# EAGLE design extruder4 (EAGLE 4.16)
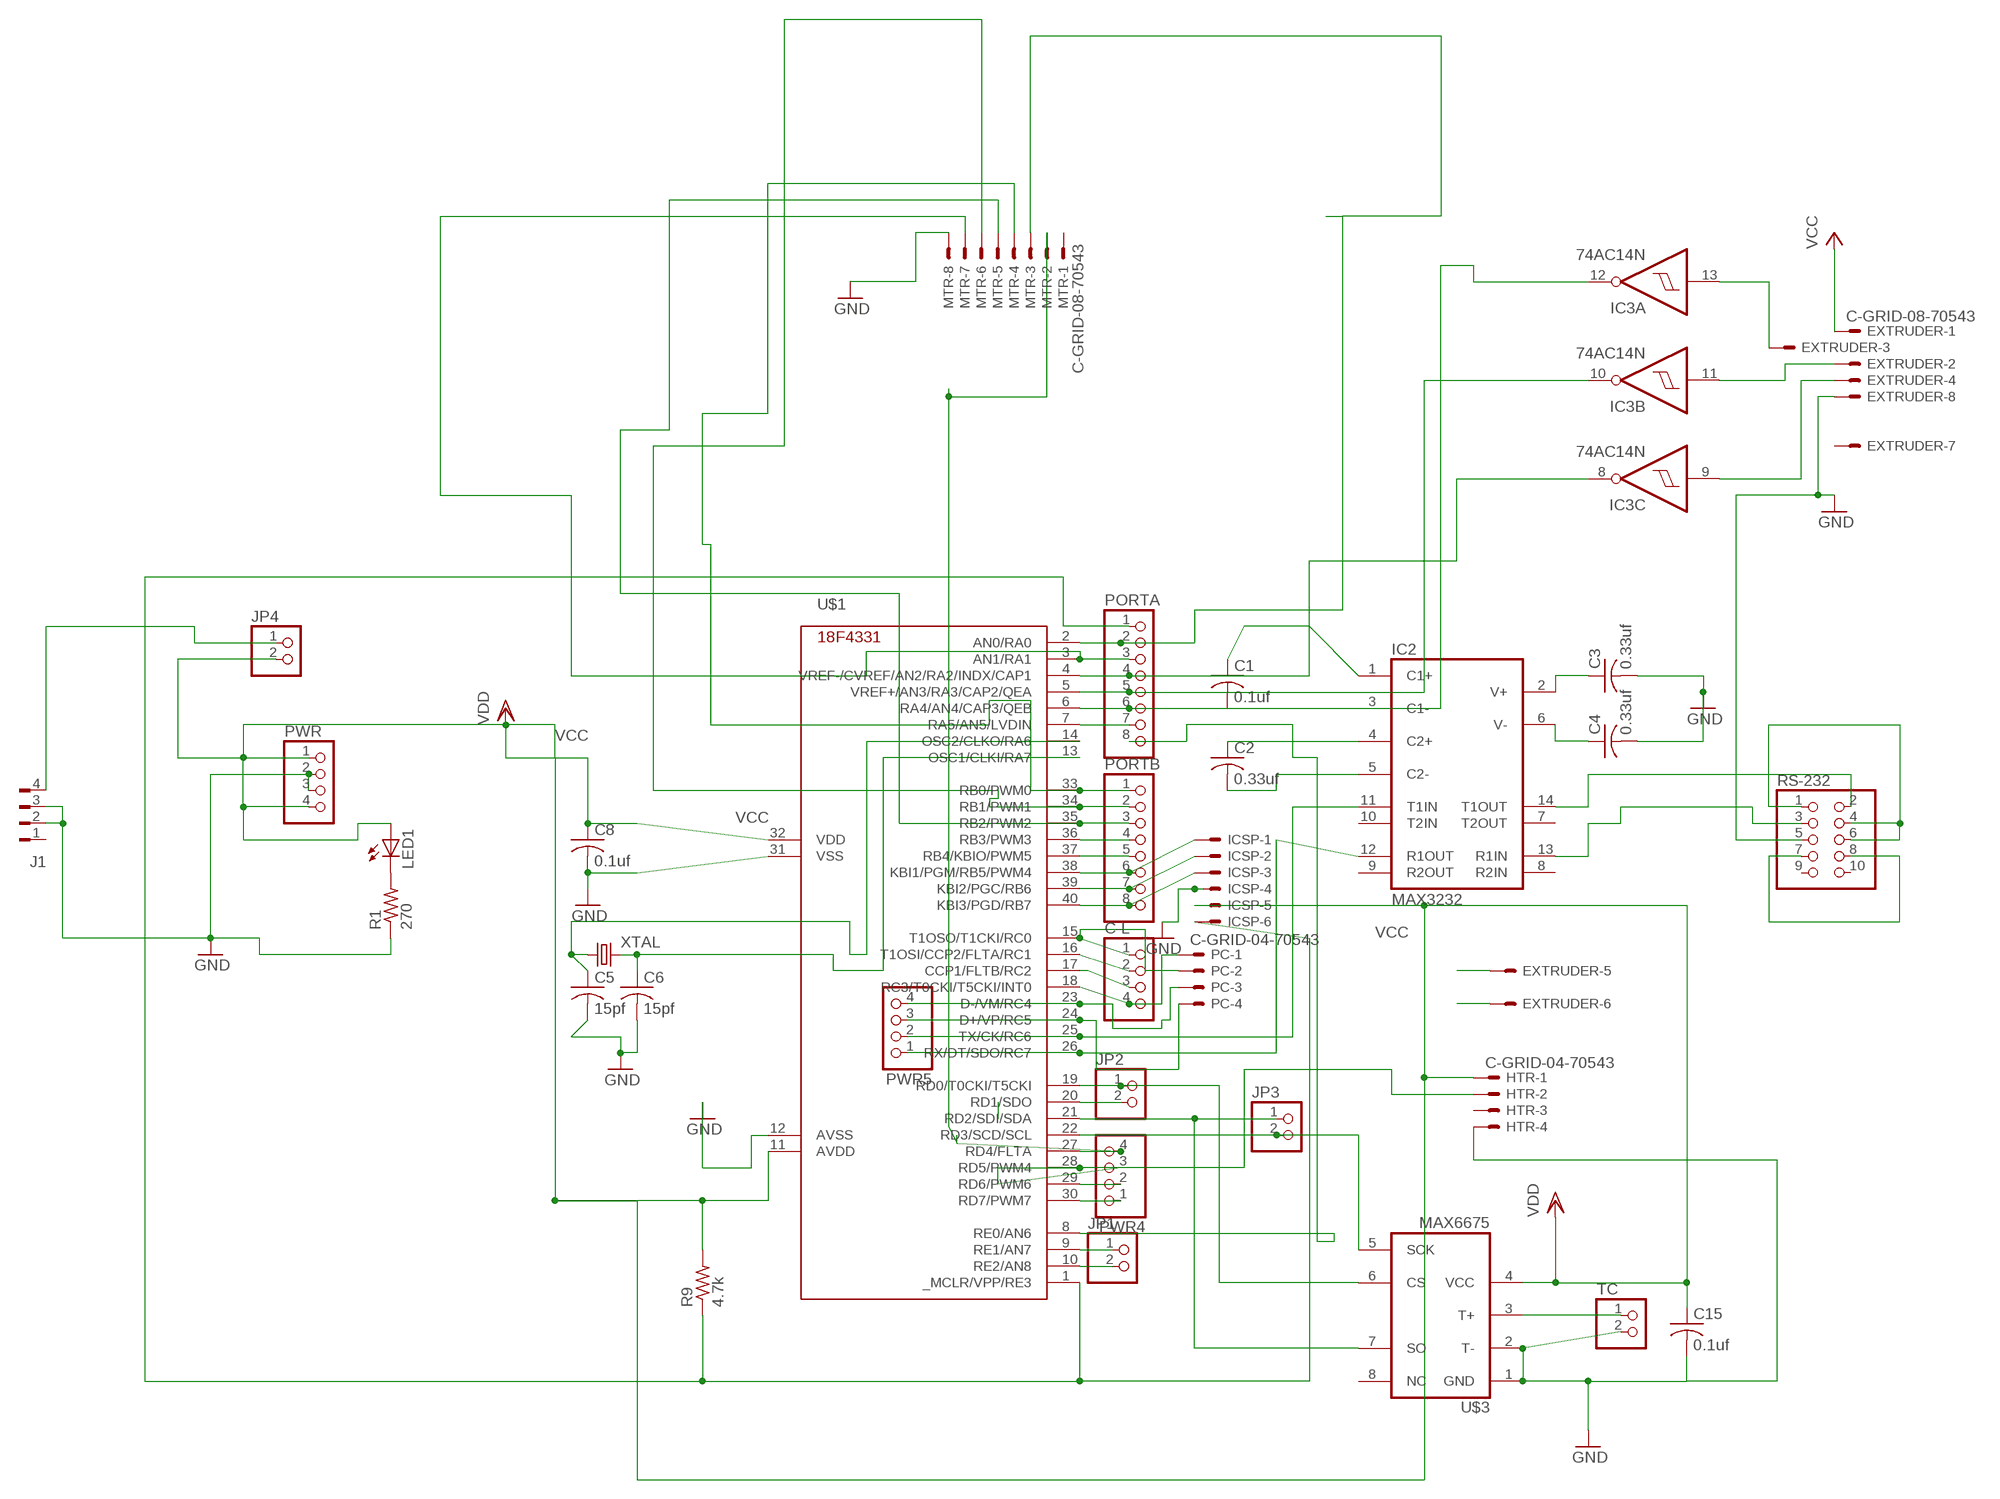
[diagram p0: schematic, sheet 1]

## Parts
C1  0.1uf  C-US025-030X050  [C025-030X050]
C2  0.33uf  C-US025-030X050  [C025-030X050]
C3  0.33uf  C-US025-030X050  [C025-030X050]
C4  0.33uf  C-US025-030X050  [C025-030X050]
C5  15pf  C-US025-030X050  [C025-030X050]
C6  15pf  C-US025-030X050  [C025-030X050]
C8  0.1uf  C-US025-030X050  [C025-030X050]
C15  0.1uf  C-US025-030X050  [C025-030X050]
C-L  PINHD-1X4  [1X04]
EXTRUDER  C-GRID-08-70543  [70543-08]
HTR  C-GRID-04-70543  [70543-04]
IC2  MAX3232  [DIL16]
IC3  74AC14N  [DIL14]
ICSP  22-23-2061  [22-23-2061]
J1  FLOP-4W827001  [827001]
JP1  PINHD-1X2  [1X02]
JP2  PINHD-1X2  [1X02]
JP3  PINHD-1X2  [1X02]
JP4  PINHD-1X2_2.54  [1X02]
LED1  LED3MM  [LED3MM]
MTR  C-GRID-08-70543  [70543-08]
PC  C-GRID-04-70543  [70543-04]
PORTA  PINHD-1X8_2.54  [1X08]
PORTB  PINHD-1X8_2.54  [1X08]
PWR  PINHD-1X4  [1X04]
PWR4  PINHD-1X4  [1X04]
PWR5  PINHD-1X4  [1X04]
R1  270  R-US_0204/5  [0204/5]
R9  4.7k  R-US_0204/2V  [0204V]
RS-232  PINHD-2X5  [2X05]
TC  PINHD-1X2  [1X02]
U$1  PIC18F4331  [DIL40]
U$3  MAX6675  [DIL08]
XTAL  CRYSTALHC49U70  [HC49U70]

## Nets
GND: C3.2 C4.2 C5.2 C6.2 C8.2 C15.2 EXTRUDER.8 HTR.4 ICSP.4 J1.2 J1.3 MTR.8 PWR.2 PWR.3 R1.1 RS-232.5 TC.2 U$1.12(AVSS) U$1.31(VSS) U$3.1(GND) U$3.2(T-)
LIMIT1: C-L.2 EXTRUDER.6 U$1.16(T1OSI/CCP2/FLTA/RC1)
LIMIT2: C-L.3 EXTRUDER.5 U$1.17(CCP1/FLTB/RC2)
N$1: C1.1 IC2.1(C1+)
N$2: J1.4 JP4.1
N$3: PC.3 PWR5.4 U$1.23(D-/VM/RC4)
N$4: C1.2 IC2.3(C1-)
N$5: C2.1 IC2.4(C2+)
N$6: C2.2 IC2.5(C2-)
N$7: C3.1 IC2.2(V+)
N$8: C4.1 IC2.6(V-)
N$10: C-L.1 PC.2 U$1.15(T1OSO/T1CKI/RC0)
N$11: MTR.3 PORTA.2 U$1.2(AN0/RA0)
N$12: EXTRUDER.3 IC3.13(A:I)
N$13: EXTRUDER.2 IC3.11(B:I)
N$14: EXTRUDER.4 IC3.9(C:I)
N$15: ICSP.1 PORTB.6 U$1.38(KBI1/PGM/RB5/PWM4)
N$16: ICSP.2 PORTB.7 U$1.39(KBI2/PGC/RB6)
N$17: ICSP.3 PORTB.8 U$1.40(KBI3/PGD/RB7)
N$18: PORTA.7 U$1.7(RA5/AN5/LVDIN)
N$19: IC3.12(A:O) PORTA.6 U$1.6(RA4/AN4/CAP3/QEB)
N$20: IC3.10(B:O) PORTA.5 U$1.5(VREF+/AN3/RA3/CAP2/QEA)
N$21: IC3.8(C:O) PORTA.4 U$1.4(VREF-/CVREF/AN2/RA2/INDX/CAP1)
N$24: C5.1 U$1.14(OSC2/CLKO/RA6) XTAL.1
N$25: C6.1 U$1.13(OSC1/CLKI/RA7) XTAL.2
N$26: IC2.12(R1OUT) PWR5.1 U$1.26(RX/DT/SDO/RC7)
N$27: IC2.11(T1IN) PWR5.2 U$1.25(TX/CK/RC6)
N$28: PORTA.8 U$1.8(RE0/AN6)
N$29: JP1.1 U$1.9(RE1/AN7)
N$30: JP1.2 U$1.10(RE2/AN8)
N$31: MTR.4 PORTB.1 U$1.33(RB0/PWM0)
N$32: MTR.5 PORTB.3 U$1.35(RB2/PWM2)
N$34: JP2.1 U$1.19(RD0/T0CKI/T5CKI) U$3.6(CS)
N$35: C-L.4 PC.1 U$1.18(RC3/T0CKI/T5CKI/INT0)
N$36: JP3.1 U$1.21(RD2/SDI/SDA) U$3.7(SO)
N$37: JP3.2 U$1.22(RD3/SCD/SCL) U$3.5(SCK)
N$38: HTR.2 PWR4.3 U$1.28(RD5/PWM4)
N$40: JP2.2 U$1.20(RD1/SDO)
N$41: PC.4 PWR5.3 U$1.24(D+/VP/RC5)
N$42: MTR.2 PWR4.4 U$1.27(RD4/FLTA)
N$43: PWR4.2 U$1.29(RD6/PWM6)
N$44: PWR4.1 U$1.30(RD7/PWM7)
N$45: ICSP.6 PORTA.1 R9.1 U$1.1(_MCLR/VPP/RE3)
N$46: TC.1 U$3.3(T+)
N$50: LED1.K(C) R1.2
N$53: RS-232.7 RS-232.8
N$54: PORTB.4 U$1.36(RB3/PWM3)
N$56: PORTB.5 U$1.37(RB4/KBIO/PWM5)
N$59: RS-232.1 RS-232.4 RS-232.6
N$61: IC2.14(T1OUT) RS-232.2
N$62: IC2.13(R1IN) RS-232.3
N$165: MTR.7 PORTA.3 U$1.3(AN1/RA1)
N$172: MTR.6 PORTB.2 U$1.34(RB1/PWM1)
VCC: C8.1 C15.1 EXTRUDER.1 HTR.1 ICSP.5 JP4.2 LED1.A PWR.1 PWR.4 R9.2 U$1.11(AVDD) U$1.32(VDD) U$3.4(VCC) ; supply symbol labelled VDD
Unconnected: EXTRUDER.7 HTR.3 IC2.7(T2OUT) IC2.8(R2IN) IC2.9(R2OUT) IC2.10(T2IN) IC3.1(D:I) IC3.2(D:O) IC3.3(E:I) IC3.4(E:O) IC3.5(F:I) IC3.6(F:O) J1.1 MTR.1 RS-232.9 RS-232.10 U$3.8(NC)

## Power pins joined to a net without a drawn wire
GND: IC2.15(GND) IC3.7(P:GND)
VCC: IC2.16(VCC) IC3.14(P:VCC)

## Library data of the parts
C1-C6 C8 C15 = rcl:C-US: CAPACITOR, American symbol
C-L PWR PWR4 PWR5 = pinhead:PINHD-1X4: PIN HEADER
EXTRUDER MTR = con-molex:C-GRID-08: CONNECTOR wire to board 2.54 mm (0.100") pitch header
HTR PC = con-molex:C-GRID-04: CONNECTOR wire to board 2.54 mm (0.100") pitch header
IC2 = maxim-9:MAX3232: RS232 TRANSEIVER
IC3 = 74xx-eu:74*14: Hex schmitt trigger INVERTER
ICSP = con-molex:22-23-2061: .100" (2.54mm) Center Header - 6 Pin
J1 = con-amp:FLOP-4W: MATE N-LOCK Floppy / HDD conector Distributor: Bürklin 71F972
JP1-JP3 TC = pinhead:PINHD-1X2: PIN HEADER
JP4 = pinhead-1:PINHD-1X2: PIN HEADER
LED1 = led:LED: LED OSRAM: - CHIPLED LG R971, LG N971, LY N971, LG Q971, LY Q971, LO R971, LY R971 LH N974, LH R974 LS Q976, LO Q976, LY Q976 LO Q996 - Hyper CHIPLED LW Q18S LB Q993, LB Q99A, LB R99A - SideLED LS A670, LO A670, LY A670, LG A670, LP A670 LB A673, LV A673, LT A673, LW A673 LH A674 LY A675 LS A676, LA A676, LO A676, LY A676, LW A676 LS A679, LY A679, LG A679 - Hyper Micro SIDELED® LS Y876, LA Y876, LO Y876, LY Y876 LT Y87S - SmartLED LW L88C, LW L88S LB L89C, LB L89S, LG L890 LS L89K, LO L89K, LY L89K LS L896, LA L896, LO L896, LY L896 - TOPLED LS T670, LO T670, LY T670, LG T670, LP T670 LSG T670, LSP T670, LSY T670, LOP T670, LYG T670 LG T671, LOG T671, LSG T671 LB T673, LV T673, LT T673, LW T673 LH T674 LS T676, LA T676, LO T676, LY T676, LB T676, LH T676, LSB T676, LW T676 LB T67C, LV T67C, LT T67C, LS T67K, LO T67K, LY T67K, LW E67C LS E67B, LA E67B, LO E67B, LY E67B, LB E67C, LV E67C, LT E67C LW T67C LS T679, LY T679, LG T679 LS T770, LO T770, LY T770, LG T770, LP T770 LB T773, LV T773, LT T773, LW T773 LH T774 LS E675, LA E675, LY E675, LS T675 LS T776, LA T776, LO T776, LY T776, LB T776 LHGB T686 LT T68C, LB T68C - Hyper Mini TOPLED® LB M676 - Mini TOPLED Santana® LG M470 LS M47K, LO M47K, LY M47K Source: http://www.osram.convergy.de - LUMILED® LXK2-PW12-R00, LXK2-PW12-S00, LXK2-PW14-U00, LXK2-PW14-V00 LXK2-PM12-R00, LXK2-PM12-S00, LXK2-PM14-U00 LXK2-PE12-Q00, LXK2-PE12-R00, LXK2-PE12-S00, LXK2-PE14-T00, LXK2-PE14-U00 LXK2-PB12-K00, LXK2-PB12-L00, LXK2-PB12-M00, LXK2-PB14-N00, LXK2-PB14-P00, LXK2-PB14-Q00 LXK2-PR12-L00, LXK2-PR12-M00, LXK2-PR14-Q00, LXK2-PR14-R00 LXK2-PD12-Q00, LXK2-PD12-R00, LXK2-PD12-S00 LXK2-PH12-R00, LXK2-PH12-S00 LXK2-PL12-P00, LXK2-PL12-Q00, LXK2-PL12-R00 Source: www.luxeon.com
PORTA PORTB = pinhead-1:PINHD-1X8: PIN HEADER
R1 R9 = rcl:R-US_: RESISTOR, American symbol
RS-232 = pinhead:PINHD-2X5: PIN HEADER
U$1 = microchip-pic18fxx5x:PIC18F4331
U$3 = maxim-9:MAX6675
XTAL = crystal:CRYSTAL: CRYSTAL

## Board
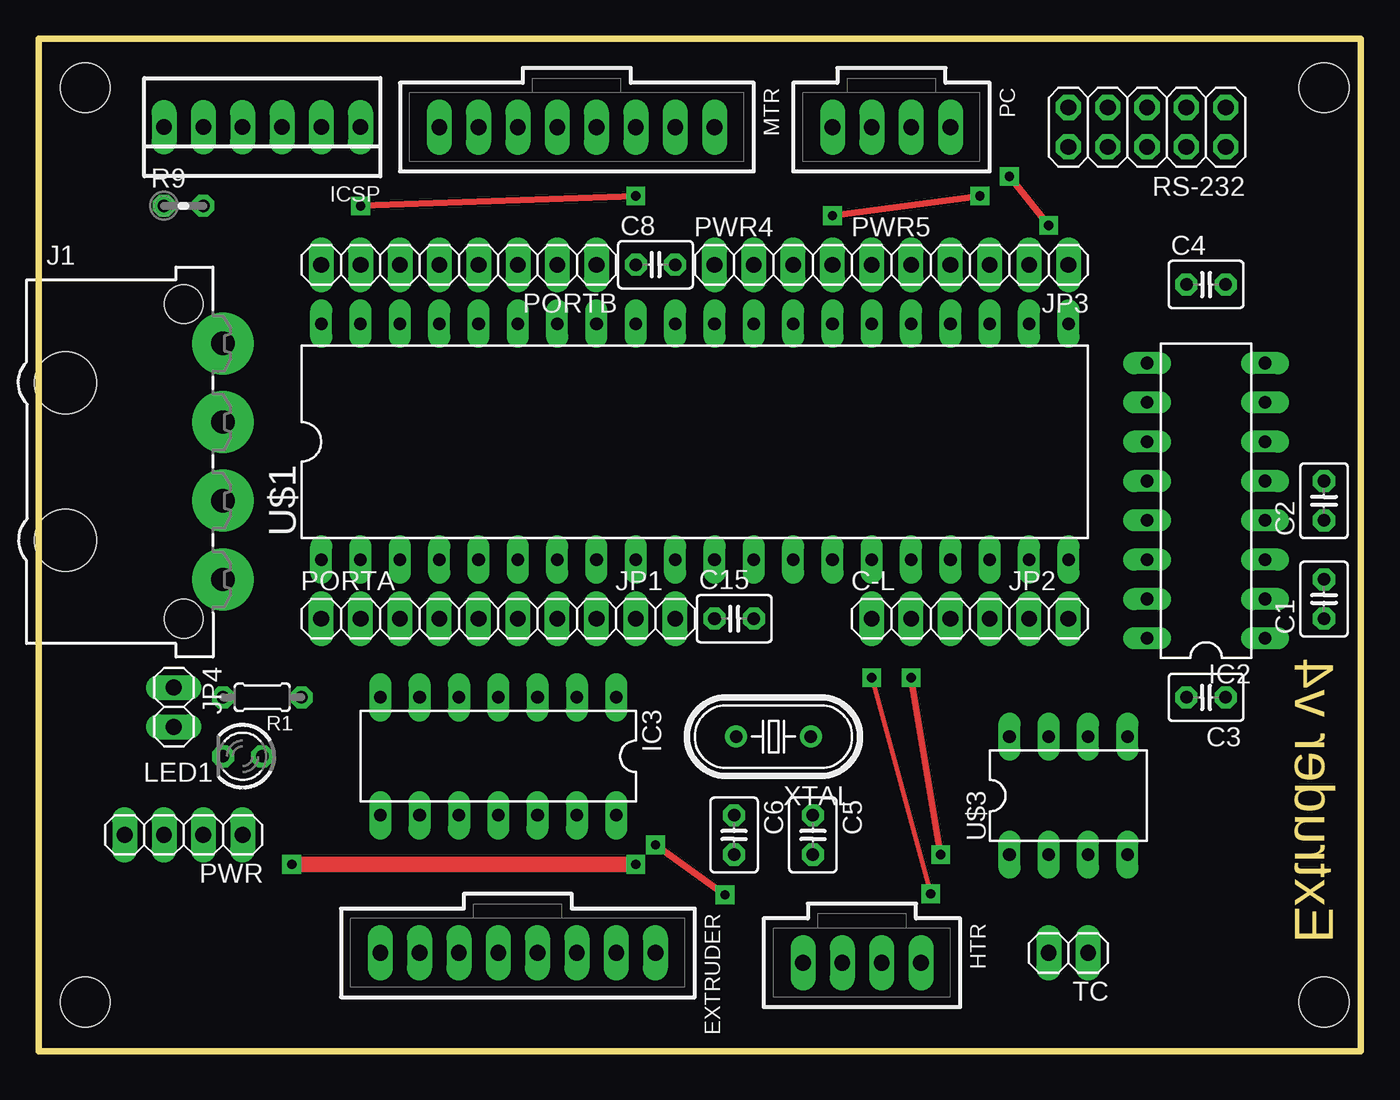
[diagram p1: board, top side]
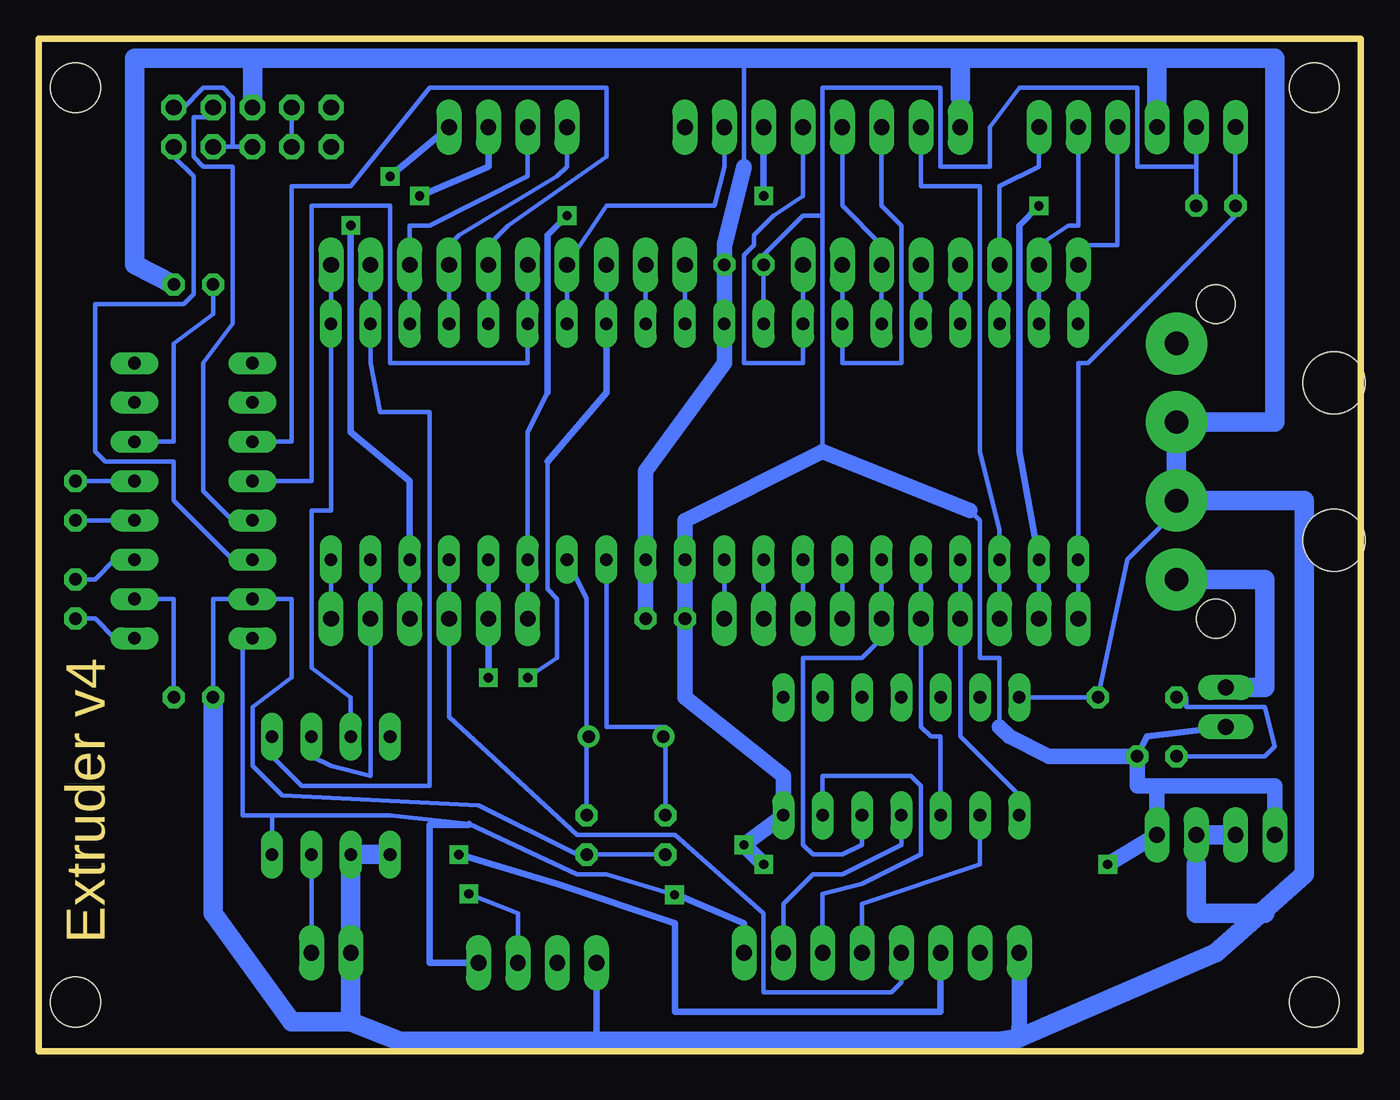
[diagram p2: board, bottom side, seen from below]

Size 85.39 x 65.4 mm. Coordinates in mm from the lower left corner, seen from the top.
Outline: 0,0 85.39,0 85.39,65.4 0,65.4 0,0
Copper layers (1*16): Top 0.035mm / dielectric 1.5mm / Bottom 0.035mm
Design rules "dave": minimum track width 12mil, minimum drill 24mil, track to track 12mil, track to pad 12mil, pad to pad 12mil, via to via 12mil, smd to smd 8mil, copper to edge 40mil, drill to drill 12mil, minimum pad ring 12mil, minimum via ring 12mil, stop-mask expansion 4mil, vias tented up to drill 0mil, thermal gap 10mil
Holes 3.2 mm at 3.01,3.17 83.02,3.17 83.02,62.22 3.01,62.22

### Footprints (pad centres in the part's own frame; a part is rotated, then mirrored left to right if it is on the bottom)
C025-030X050 = drill 0.813 octagon: 1 -1.27,0; 2 1.27,0
1X04 = drill 1.016 long: 1 -3.81,0; 2 -1.27,0; 3 1.27,0; 4 3.81,0
70543-08 = drill 1.016 long: 1 -8.89,0; 2 -6.35,0; 3 -3.81,0; 4 -1.27,0; 5 1.27,0; 6 3.81,0; 7 6.35,0; 8 8.89,0
70543-04 = drill 1.016 long: 1 -3.81,0; 2 -1.27,0; 3 1.27,0; 4 3.81,0
DIL16 = drill 0.813 long: 1 -8.89,-3.81; 2 -6.35,-3.81; 3 -3.81,-3.81; 4 -1.27,-3.81; 5 1.27,-3.81; 6 3.81,-3.81; 7 6.35,-3.81; 8 8.89,-3.81; 9 8.89,3.81; 10 6.35,3.81; 11 3.81,3.81; 12 1.27,3.81; 13 -1.27,3.81; 14 -3.81,3.81; 15 -6.35,3.81; 16 -8.89,3.81
DIL14 = drill 0.813 long: 1 -7.62,-3.81; 2 -5.08,-3.81; 3 -2.54,-3.81; 4 0,-3.81; 5 2.54,-3.81; 6 5.08,-3.81; 7 7.62,-3.81; 8 7.62,3.81; 9 5.08,3.81; 10 2.54,3.81; 11 0,3.81; 12 -2.54,3.81; 13 -5.08,3.81; 14 -7.62,3.81
22-23-2061 = drill 1 long: 1 -6.35,0; 2 -3.81,0; 3 -1.27,0; 4 1.27,0; 5 3.81,0; 6 6.35,0
827001 = drill 1.5 pad 4 round: 1 -7.62,0; 2 -2.54,0; 3 2.54,0; 4 7.62,0 | hole 4: 5.08,-10.16; -5.08,-10.16 | hole 2.5: 10.16,-2.54; -10.16,-2.54
1X02 = drill 1.016 long: 1 -1.27,0; 2 1.27,0
LED3MM = drill 0.813 octagon: A -1.27,0; K 1.27,0
1X08 = drill 1.016 long: 1 -8.89,0; 2 -6.35,0; 3 -3.81,0; 4 -1.27,0; 5 1.27,0; 6 3.81,0; 7 6.35,0; 8 8.89,0
0204/5 = drill 0.813 octagon: 1 -2.54,0; 2 2.54,0
0204V = drill 0.813 octagon: 1 -1.27,0; 2 1.27,0
2X05 = drill 1.016 octagon: 1 -5.08,-1.27; 2 -5.08,1.27; 3 -2.54,-1.27; 4 -2.54,1.27; 5 0,-1.27; 6 0,1.27; 7 2.54,-1.27; 8 2.54,1.27; 9 5.08,-1.27; 10 5.08,1.27
DIL40 = drill 0.813 long: 1 -24.13,-7.62; 2 -21.59,-7.62; 3 -19.05,-7.62; 4 -16.51,-7.62; 5 -13.97,-7.62; 6 -11.43,-7.62; 7 -8.89,-7.62; 8 -6.35,-7.62; 9 -3.81,-7.62; 10 -1.27,-7.62; 11 1.27,-7.62; 12 3.81,-7.62; 13 6.35,-7.62; 14 8.89,-7.62; 15 11.43,-7.62; 16 13.97,-7.62; 17 16.51,-7.62; 18 19.05,-7.62; 19 21.59,-7.62; 20 24.13,-7.62; 21 24.13,7.62; 22 21.59,7.62; 23 19.05,7.62; 24 16.51,7.62; 25 13.97,7.62; 26 11.43,7.62; 27 8.89,7.62; 28 6.35,7.62; 29 3.81,7.62; 30 1.27,7.62; 31 -1.27,7.62; 32 -3.81,7.62; 33 -6.35,7.62; 34 -8.89,7.62; 35 -11.43,7.62; 36 -13.97,7.62; 37 -16.51,7.62; 38 -19.05,7.62; 39 -21.59,7.62; 40 -24.13,7.62
DIL08 = drill 0.813 long: 1 -3.81,-3.81; 2 -1.27,-3.81; 3 1.27,-3.81; 4 3.81,-3.81; 5 3.81,3.81; 6 1.27,3.81; 7 -1.27,3.81; 8 -3.81,3.81
HC49U70 = drill 0.813 round: 1 -2.413,0; 2 2.413,0

### Placement (x,y rotation side)
C1  83.02,29.21 90 top
C2  83.02,35.55 90 top
C3  75.4,22.86 180 top
C4  75.4,49.52 0 top
C5  50,13.96 270 top
C6  44.92,13.96 270 top
C8  39.84,50.79 0 top
C15  44.92,27.94 0 top
C-L  57.62,27.94 0 top
EXTRUDER  30.95,6.34 180 top
HTR  53.18,5.71 180 top
IC2  75.4,35.55 90 top
IC3  29.68,19.05 180 top
ICSP  14.44,59.68 180 top
J1  11.9,38.09 270 top
JP1  39.84,27.94 0 top
JP2  65.24,27.94 0 top
JP3  65.24,50.79 180 top
JP4  8.73,22.22 270 top
LED1  13.17,19.05 180 top
MTR  34.76,59.68 180 top
PC  55.08,59.68 180 top
PORTA  27.14,27.94 0 top
PORTB  27.14,50.79 180 top
PWR  9.36,13.96 180 top
PWR4  47.46,50.79 0 top
PWR5  57.62,50.79 0 top
R1  14.44,22.86 180 top
R9  9.36,54.6 0 top
RS-232  71.59,59.68 180 top
TC  66.51,6.34 180 top
U$1  42.38,39.36 0 top
U$3  66.51,16.51 0 top
XTAL  47.46,20.32 180 top

### Tracks (layer width: path | path; a pad name or v marks a point on that pad's centre or on a via)
GND
  Bottom 0.305: 10.63,12.06 PWR.2 | C6.2 C5.2 50.63,12.69 56.98,15.87 69.68,16.51 71.59,18.41 71.59,22.22 69.05,24.12 69.05,29.21 IC2.15 74.13,29.21 C3.2 | IC3.7 R1.1 15.08,31.75 12.54,34.28 J1.3 | 25.87,61.59 MTR.8 | 39.84,64.13 39.84,57.14
  Bottom 0.406: 49.37,0.63 HTR.4
  Bottom 1.016: C15.2 U$1.12 46.19,37.46 41.11,44.45 U$1.31 C8.2 41.11,52.06 39.84,57.14 | 22.12,0.82 22.06,1.9 EXTRUDER.8
  Bottom 1.27: PWR.2 PWR.3 | 10.63,12.06 10.63,8.88 6.18,8.88 6.18,9.04 6.33,9.04 | U$3.1 U$3.2 TC.2 65.24,1.9 | 65.24,1.9 69.05,1.9 74.13,8.88 C3.2 | 65.24,1.9 62.06,0.63 49.37,0.63 23.33,0.63 22.12,0.82 9.36,6.34 6.33,9.04 | 71.59,64.13 79.21,64.13 79.21,50.79 C4.2 | 13.17,64.13 25.87,64.13 | 25.87,64.13 25.87,61.59 | 13.17,64.13 5.55,64.13 5.55,40.63 J1.2 J1.3 3.65,35.55 3.65,11.42 6.33,9.04 | 13.17,64.13 ICSP.4 | 25.87,64.13 39.84,64.13 71.59,64.13 | 71.59,64.13 RS-232.5
LIMIT1  (via drill 0.6)
  Top 0.406: v58.26,12.69 v56.35,24.12
  Bottom 0.305: C-L.2 U$1.16
  Bottom 0.406: EXTRUDER.6 27.14,2.54 44.29,2.54 44.29,8.25 51.91,10.79 v58.26,12.69 | v56.35,24.12 C-L.2
LIMIT2
  Bottom 0.305: U$1.17 C-L.3 58.89,21.59 50.63,13.96 44.29,13.96 38.57,8.88 38.57,3.81 30.32,3.81 29.68,4.44 EXTRUDER.5
N$1
  Bottom 0.305: IC2.1 80.48,26.67 81.75,27.94 C1.1
N$2
  Bottom 1.27: JP4.1 6.18,23.49 6.18,30.48 J1.4
N$3
  Bottom 0.305: U$1.23 PWR5.4 61.43,53.34 60.16,53.34 53.81,56.51 PC.3
N$4
  Bottom 0.305: IC2.3 80.48,31.75 81.75,30.48 C1.2
N$5
  Bottom 0.305: IC2.4 C2.1
N$6
  Bottom 0.305: IC2.5 C2.2
N$7
  Bottom 0.305: C3.1 76.67,29.21 IC2.2
N$8
  Bottom 0.305: C4.1 74.13,47.62 76.67,45.71 76.67,39.36 IC2.6
N$10  (via drill 0.6)
  Top 0.406: v51.27,53.97 v60.8,55.24
  Bottom 0.305: C-L.1 U$1.15 53.81,40 52.54,42.54
  Bottom 0.406: PC.2 56.35,57.14 v60.8,55.24 | 52.54,42.54 52.54,52.7 v51.27,53.97
N$11  (via drill 0.6)
  Top 0.406: v20.79,54.6 v38.57,55.24
  Bottom 0.305: PORTA.2 U$1.2
  Bottom 0.406: v38.57,55.24 MTR.3 | v20.79,54.6 22.06,53.34 22.06,38.73 U$1.2
N$12
  Bottom 0.305: IC3.13 34.76,17.78 29.05,17.78 28.41,17.14 28.41,12.69 32.22,10.79 34.76,10.15 EXTRUDER.3
N$13
  Bottom 0.305: IC3.11 29.68,13.33 33.49,11.42 35.4,11.42 37.3,9.52 EXTRUDER.2
N$14
  Bottom 0.305: IC3.9 24.6,12.06 32.22,9.52 EXTRUDER.4
N$15
  Bottom 0.305: U$1.38 PORTB.6 23.33,55.88 20.79,57.14 ICSP.1
N$16
  Bottom 0.305: U$1.39 PORTB.7 20.79,52.06 18.89,53.34 18.25,53.34 ICSP.2
N$17
  Bottom 0.305: U$1.40 PORTB.8 17.62,52.06 15.71,52.06 ICSP.3
N$18
  Bottom 0.305: PORTA.7 U$1.7
N$19
  Bottom 0.305: IC3.12 32.22,13.33 33.49,12.69 35.4,12.69 36.03,13.33 36.03,25.39 32.22,25.39 30.95,26.67 PORTA.6 U$1.6
N$20
  Bottom 0.305: IC3.10 27.14,20.32 27.78,20.32 28.41,20.95 PORTA.5 U$1.5
N$21
  Bottom 0.305: IC3.8 22.06,16.51 25.87,20.32 PORTA.4 U$1.4
N$24
  Bottom 0.305: C5.1 50,19.68 XTAL.1 50,20.95 50,29.21 U$1.14
N$25
  Bottom 0.305: C6.1 44.92,19.68 XTAL.2 44.92,20.95 48.73,20.95 U$1.13
N$26
  Bottom 0.305: PWR5.1 U$1.26 53.81,44.45 62.7,44.45 62.7,54.6 67.78,54.6 67.78,36.82 IC2.12
N$27
  Bottom 0.305: U$1.25 PWR5.2 56.35,52.06 55.08,53.34 48.73,57.78 48.73,62.22 60.16,62.22 65.24,55.88 69.05,55.88 69.05,39.36 IC2.11
N$28
  Bottom 0.305: PORTA.8 U$1.8
N$29
  Bottom 0.305: JP1.1 U$1.9
N$30
  Bottom 0.305: JP1.2 U$1.10
N$31
  Bottom 0.305: PORTB.1 U$1.33 36.03,44.45 39.84,44.45 39.84,51.43 39.2,52.06 39.2,52.7 37.94,53.97 36.03,55.24 MTR.4
N$32
  Bottom 0.305: U$1.35 PORTB.3 30.95,52.06 33.49,54.6 MTR.5
N$34
  Bottom 0.305: U$3.6 67.78,19.05 66.51,18.41 63.97,17.78 JP2.1 U$1.19
N$35  (via drill 0.6)
  Top 0.406: v65.24,53.34 v62.7,56.51
  Bottom 0.305: C-L.4 U$1.18
  Bottom 0.406: v62.7,56.51 PC.1 | U$1.18 61.43,36.82 65.24,40 v65.24,53.34
N$36
  Bottom 0.305: U$3.7 65.24,22.86 67.78,24.76 67.78,34.92 66.51,34.92 U$1.21 JP3.1
N$37
  Bottom 0.305: JP3.2 U$1.22 63.97,44.45 63.34,41.27 60.16,41.27 60.16,17.14 68.41,17.14 70.32,19.05 U$3.5
N$38  (via drill 0.6)
  Top 0.305: v57.62,10.15 v53.81,24.12
  Bottom 0.305: U$1.28 PWR4.3 | 52.54,38.09 52.54,29.84 51.91,29.21 51.91,25.39 v53.81,24.12 | HTR.2 54.45,8.88 v57.62,10.15
  Bottom 0.406: U$1.28 48.73,42.54 52.54,38.09
N$40
  Bottom 0.305: JP2.2 U$1.20
N$41
  Bottom 0.305: U$1.24 PWR5.3 58.89,52.06 58.26,52.7 51.91,56.51 51.27,57.14 PC.4
N$42
  Bottom 0.305: U$1.27 PWR4.4 48.73,54.6 41.74,54.6 41.11,57.14 MTR.2
N$43
  Bottom 0.305: U$1.29 PWR4.2
N$44
  Bottom 0.305: U$1.30 PWR4.1
N$45
  Bottom 0.305: PORTA.1 U$1.1 18.25,44.45 17.62,44.45 8.09,53.97 R9.1 ICSP.6
N$46
  Bottom 0.305: TC.1 U$3.3
N$50
  Bottom 0.305: LED1.K 6.18,19.05 5.55,19.68 6.18,22.22 11.27,22.22 11.27,22.86 R1.2
N$53
  Bottom 0.305: RS-232.8 RS-232.7
N$54
  Bottom 0.305: U$1.36 PORTB.4
N$56
  Bottom 0.305: U$1.37 PORTB.5
N$59
  Bottom 0.305: RS-232.6 72.86,58.41 | 72.86,58.41 RS-232.4 | 72.86,58.41 72.86,61.59 73.49,62.22 74.77,62.22 76.03,60.95 RS-232.1
N$61
  Bottom 0.305: IC2.14 72.86,31.75 76.67,35.55 76.67,38.09 81.11,38.09 81.75,38.73 81.75,48.25 76.03,48.25 75.4,48.89 75.4,56.51 76.67,57.78 RS-232.2
N$62
  Bottom 0.305: IC2.13 72.86,34.28 74.77,36.19 74.77,44.45 72.86,46.98 72.86,57.14 74.77,57.14 75.4,57.78 75.4,60.32 74.13,60.32 RS-232.3
N$165
  Bottom 0.305: PORTA.3 U$1.3 23.33,33.65 24.6,38.73 24.6,55.88 28.41,55.88 MTR.7
N$172
  Bottom 0.305: PORTB.2 U$1.34 33.49,44.45 29.68,44.45 29.68,53.34 30.95,54.6 MTR.6
VCC  (via drill 0.6)
  Top 0.406: v39.84,13.33 v44.33,10.09
  Top 1.016: v16.35,12.06 v38.57,12.06
  Bottom 0.305: 70.32,15.23 72.22,15.23 72.22,26.03 IC2.16 | 70.32,15.23 U$3.4 | v44.33,10.09 48.73,11.42 50.63,11.42 57.59,14.68 62.7,15.23 70.32,15.23 | 39.84,8.25 EXTRUDER.1 | LED1.A 13.81,19.05 | 10.63,57.14 R9.2 | 10.63,57.14 ICSP.5 | U$1.32 C8.1 38.57,51.43 36.03,53.97 34.76,53.97 | 34.76,38.73 34.76,53.97 | 10.63,57.14 14.44,57.14 14.44,62.22 22.06,62.22 23.96,59.68 23.96,57.14 27.14,57.14 27.14,62.22 34.76,62.22 34.76,53.97 | 23.33,20.95 23.33,25.39 24.6,25.39 24.6,34.28 25.23,34.92
  Bottom 0.406: JP4.2 13.81,20.32 LED1.A | v38.57,12.06 v39.84,13.33 | 39.84,8.25 44.29,10.15 v44.33,10.09 | 57.59,14.68 57.62,14.6 60.16,14.6 60.16,5.71 HTR.1
  Bottom 1.016: 13.17,17.14 PWR.1 v16.35,12.06 | 13.17,17.14 5.55,17.14 PWR.4 | 13.17,17.14 14.44,17.14 LED1.A 20.16,19.05 22.7,20.32 23.33,20.95 | 25.23,34.92 34.76,38.73 43.65,34.28 U$1.11 C15.1 43.65,22.86 37.3,17.78 IC3.14 v39.84,13.33 v38.57,12.06

### Text on the board
Dimension: Extruder v4